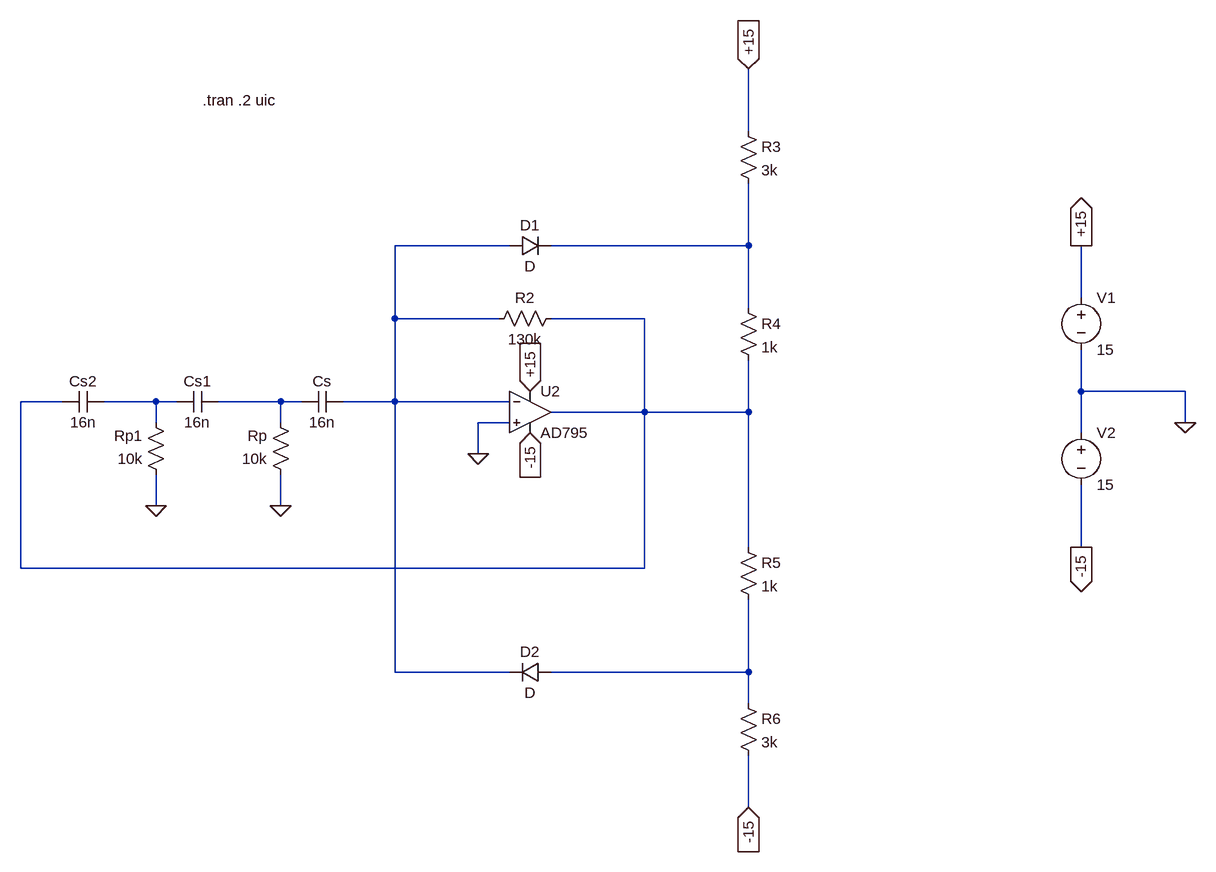
[diagram p0: schematic Oscilador_Deslocamento_de_fase.asc]
Oscilador_Deslocamento_de_fase.asc, the LTspice schematic file:
Version 4
SHEET 1 1220 912
WIRE 528 -240 528 -336
WIRE 160 -64 -16 -64
WIRE 528 -64 528 -160
WIRE 528 -64 224 -64
WIRE 1040 16 1040 -64
WIRE 528 32 528 -64
WIRE -16 48 -16 -64
WIRE 144 48 -16 48
WIRE 368 48 224 48
WIRE 1040 160 1040 96
WIRE 1200 160 1040 160
WIRE -528 176 -592 176
WIRE -384 176 -464 176
WIRE -352 176 -384 176
WIRE -192 176 -288 176
WIRE -160 176 -192 176
WIRE -16 176 -16 48
WIRE -16 176 -96 176
WIRE 160 176 -16 176
WIRE 368 192 368 48
WIRE 368 192 224 192
WIRE 528 192 528 112
WIRE 528 192 368 192
WIRE -384 208 -384 176
WIRE -192 208 -192 176
WIRE 160 208 112 208
WIRE 1200 208 1200 160
WIRE 1040 224 1040 160
WIRE 112 256 112 208
WIRE -384 336 -384 288
WIRE -192 336 -192 288
WIRE 528 400 528 192
WIRE 1040 400 1040 304
WIRE -592 432 -592 176
WIRE 368 432 368 192
WIRE 368 432 -592 432
WIRE -16 592 -16 176
WIRE 160 592 -16 592
WIRE 528 592 528 480
WIRE 528 592 224 592
WIRE 528 640 528 592
WIRE 528 800 528 720
FLAG -192 336 0
FLAG 112 256 0
FLAG 528 -336 +15
IOPIN 528 -336 In
FLAG 528 800 -15
IOPIN 528 800 In
FLAG 1200 208 0
FLAG 1040 -64 +15
IOPIN 1040 -64 Out
FLAG 1040 400 -15
IOPIN 1040 400 Out
FLAG 192 160 +15
IOPIN 192 160 In
FLAG 192 224 -15
IOPIN 192 224 In
FLAG -384 336 0
SYMBOL res 240 32 R90
WINDOW 0 0 56 VBottom 2
WINDOW 3 32 56 VTop 2
SYMATTR InstName R2
SYMATTR Value 130k
SYMBOL res -176 304 R180
WINDOW 0 36 76 Left 2
WINDOW 3 36 40 Left 2
SYMATTR InstName Rp
SYMATTR Value 10k
SYMBOL cap -96 160 R90
WINDOW 0 0 32 VBottom 2
WINDOW 3 32 32 VTop 2
SYMATTR InstName Cs
SYMATTR Value 16n
SYMBOL diode 160 -48 R270
WINDOW 0 32 32 VTop 2
WINDOW 3 0 32 VBottom 2
SYMATTR InstName D1
SYMBOL diode 224 576 R90
WINDOW 0 0 32 VBottom 2
WINDOW 3 32 32 VTop 2
SYMATTR InstName D2
SYMBOL res 512 384 R0
SYMATTR InstName R5
SYMATTR Value 1k
SYMBOL res 512 16 R0
SYMATTR InstName R4
SYMATTR Value 1k
SYMBOL res 512 -256 R0
SYMATTR InstName R3
SYMATTR Value 3k
SYMBOL res 512 624 R0
SYMATTR InstName R6
SYMATTR Value 3k
SYMBOL voltage 1040 0 R0
WINDOW 123 0 0 Left 2
WINDOW 39 24 124 Left 2
SYMATTR InstName V1
SYMATTR Value 15
SYMBOL voltage 1040 208 R0
WINDOW 123 0 0 Left 2
WINDOW 39 0 0 Left 2
SYMATTR InstName V2
SYMATTR Value 15
SYMBOL Opamps\\AD795 192 128 R0
SYMATTR InstName U2
SYMBOL res -368 304 R180
WINDOW 0 36 76 Left 2
WINDOW 3 36 40 Left 2
SYMATTR InstName Rp1
SYMATTR Value 10k
SYMBOL cap -288 160 R90
WINDOW 0 0 32 VBottom 2
WINDOW 3 32 32 VTop 2
SYMATTR InstName Cs1
SYMATTR Value 16n
SYMBOL cap -464 160 R90
WINDOW 0 0 32 VBottom 2
WINDOW 3 32 32 VTop 2
SYMATTR InstName Cs2
SYMATTR Value 16n
TEXT -312 -288 Left 2 !.tran .2 uic

The netlist it stands for:
* Oscilador_Deslocamento_de_fase.asc
R2 N003 N001 130k
Rp 0 N005 10k
Cs N001 N005 16n
D1 N001 N002 D
D2 N006 N001 D
R5 N003 N006 1k
R4 N002 N003 1k
R3 +15 N002 3k
R6 N006 -15 3k
V1 +15 0 15
V2 0 -15 15
XU2 0 N001 +15 -15 N003 AD795  ; pins In+ In- V+ V- OUT
Rp1 0 N004 10k
Cs1 N005 N004 16n
Cs2 N004 N003 16n
.model D D
.lib standard.dio
.tran .2 uic
.lib ADI1.lib
.backanno
.end